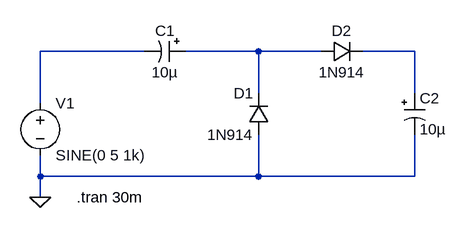
[diagram p0: schematic lab2_podvouvach_naprugi.asc]
lab2_podvouvach_naprugi.asc, the LTspice schematic file:
Version 4
SHEET 1 880 680
WIRE 192 48 32 48
WIRE 368 48 256 48
WIRE 464 48 368 48
WIRE 608 48 528 48
WIRE 368 112 368 48
WIRE 608 112 608 48
WIRE 32 128 32 48
WIRE 32 240 32 208
WIRE 368 240 368 176
WIRE 368 240 32 240
WIRE 608 240 608 176
WIRE 608 240 368 240
WIRE 32 272 32 240
FLAG 32 272 0
SYMBOL voltage 32 112 R0
WINDOW 123 0 0 Left 2
WINDOW 39 0 0 Left 2
SYMATTR InstName V1
SYMATTR Value SINE(0 5 1k)
SYMBOL polcap 256 32 R90
WINDOW 0 0 32 VBottom 2
WINDOW 3 32 32 VTop 2
SYMATTR InstName C1
SYMATTR Value 10µ
SYMBOL diode 384 176 R180
WINDOW 0 24 64 Left 2
WINDOW 3 24 0 Left 2
SYMATTR InstName D1
SYMATTR Value 1N914
SYMBOL diode 464 64 R270
WINDOW 0 32 32 VTop 2
WINDOW 3 0 32 VBottom 2
SYMATTR InstName D2
SYMATTR Value 1N914
SYMBOL polcap 592 112 R0
SYMATTR InstName C2
SYMATTR Value 10µ
TEXT 88 272 Left 2 !.tran 30m

The netlist it stands for:
* lab2_podvouvach_naprugi.asc
V1 N001 0 SINE(0 5 1k)
C1 N002 N001 10µ
D1 0 N002 1N914
D2 N002 N003 1N914
C2 N003 0 10µ
.model D D
.lib standard.dio
.tran 30m
.backanno
.end